# EAGLE design PCB_Tutorial (EAGLE 9.3.0)
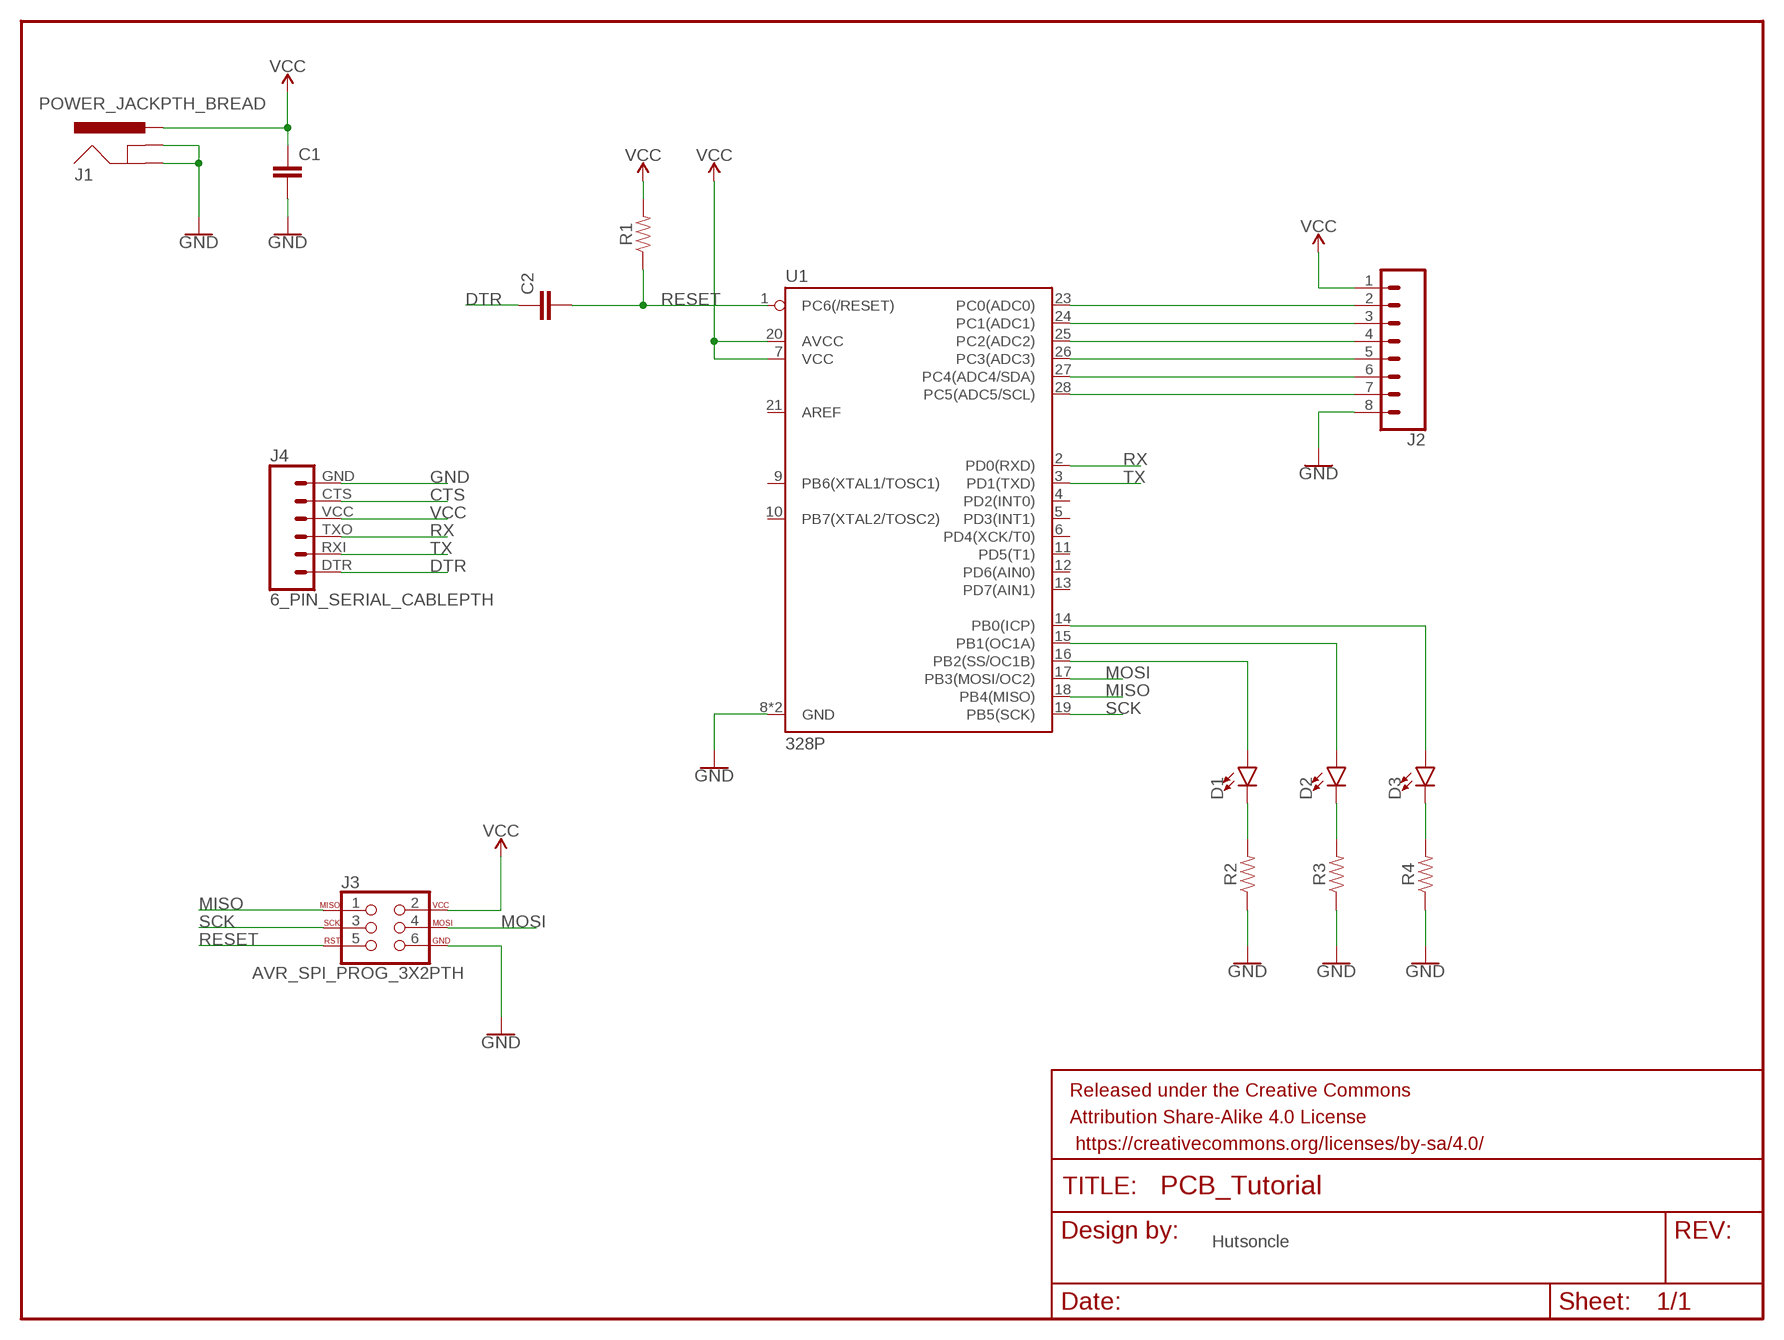
[diagram p0: schematic, sheet 1]

## Parts
C1  0.1uF  0.1UF-KIT-EZ-50V-20%  [CAP-PTH-SMALL-KIT]
C2  0.1uF  0.1UF-KIT-EZ-50V-20%  [CAP-PTH-SMALL-KIT]
D1  LED5MM  [LED_5MM]
D2  LED5MM  [LED_5MM]
D3  LED5MM  [LED_5MM]
FRAME1  FRAME-LETTER  [CREATIVE_COMMONS]
J1  POWER_JACKPTH_BREAD  [POWER_JACK_PTH_BREAD]
J2  CONN_08"  [1X08]
J3  AVR_SPI_PROG_3X2PTH  [2X3]
J4  6_PIN_SERIAL_CABLEPTH  [FTDI_BASIC]
R1  RESISTORAXIAL-0.3  [AXIAL-0.3]
R2  RESISTORAXIAL-0.3  [AXIAL-0.3]
R3  RESISTORAXIAL-0.3  [AXIAL-0.3]
R4  RESISTORAXIAL-0.3  [AXIAL-0.3]
U1  328P  ATMEGA328P_PDIP  [DIP28]

## Nets
CTS: J4.CTS
DTR: C2.1 J4.DTR
GND: C1.2 J1.GND J1.GNDBREAK J2.8 J3.6 J4.GND R2.P$1 R3.P$1 R4.P$1 U1.8(GND) U1.22(GND)
MISO: J3.1 U1.18(PB4(MISO))
MOSI: J3.4 U1.17(PB3(MOSI/OC2))
N$3: J2.2 U1.23(PC0(ADC0))
N$4: J2.3 U1.24(PC1(ADC1))
N$5: J2.4 U1.25(PC2(ADC2))
N$6: J2.5 U1.26(PC3(ADC3))
N$7: J2.6 U1.27(PC4(ADC4/SDA))
N$8: J2.7 U1.28(PC5(ADC5/SCL))
N$9: D1.K(C) R2.P$2
N$10: D2.K(C) R3.P$2
N$11: D3.K(C) R4.P$2
N$12: D3.A U1.14(PB0(ICP))
N$13: D2.A U1.15(PB1(OC1A))
N$14: D1.A U1.16(PB2(SS/OC1B))
RESET: C2.2 J3.5 R1.P$1 U1.1(PC6(/RESET))
RX: J4.TXO U1.2(PD0(RXD))
SCK: J3.3 U1.19(PB5(SCK))
TX: J4.RXI U1.3(PD1(TXD))
VCC: C1.1 J1.PWR J2.1 J3.2 J4.VCC R1.P$2 U1.7(VCC) U1.20(AVCC)
Unconnected: U1.4(PD2(INT0)) U1.5(PD3(INT1)) U1.6(PD4(XCK/T0)) U1.9(PB6(XTAL1/TOSC1)) U1.10(PB7(XTAL2/TOSC2)) U1.11(PD5(T1)) U1.12(PD6(AIN0)) U1.13(PD7(AIN1)) U1.21(AREF)

## Notes on the sheet
- Hutsoncle

## Library data of the parts
C1 C2 = SparkFun-Capacitors:0.1UF: 0.1µF ceramic capacitors A capacitor is a passive two-terminal electrical component used to store electrical energy temporarily in an electric field.; PROD_ID: CAP-08370
D1-D3 = SparkFun-LED:LED: LED (Generic) Standard schematic elements and footprints for 5mm, 3mm, 1206, and 0603 sized LEDs. Generic LEDs with no color specified.
FRAME1 = SparkFun-Aesthetics:FRAME-LETTER: Schematic Frame - Letter Standard 8.5x11 US Letter frame
J1 = SparkFun-Connectors:POWER_JACK: Power Jack Connector This is the standard 5.5mm barrel jack for power. The PTH is the most common, proven, reliable, footprint. The Slot footprint only works if the mill layer is transmitted to the PCB fab house so be warned. Here are the connectors we sell at SparkFun: DC Barrel Power Jack/Connector <https://www.sparkfun.com/products/119> (PRT-00119) DC Barrel Power Jack/Connector (SMD) <https://www.sparkfun.com/products/12748> (PRT-12748) DC Barrel Jack Adapter - Breadboard Compatible <https://www.sparkfun.com/products/10811> (PRT-10811) It is used on this SparkFun product (and many, many others): SparkFun RedBoard - Programmed with Arduino <https://www.sparkfun.com/products/12757> (DEV-12757) Also, if you need a mating power supply or connector, please check these out: Wall Adapter Power Supply - 9VDC 650mA <https://www.sparkfun.com/products/298> (TOL-00298) DC Barrel Jack Adapter - Male <https://www.sparkfun.com/products/10287> (PRT-10287); PROD_ID: PRT-10811
J2 = SparkFun-Connectors:CONN_08: Multi connection point. Often used as Generic Header-pin footprint for 0.1 inch spaced/style header connections On any of the 0.1 inch spaced packages, you can populate with these: Break Away Headers - Straight <https://www.sparkfun.com/products/116> (PRT-00116) Break Away Male Headers - Right Angle <https://www.sparkfun.com/products/553> (PRT-00553) Female Headers <https://www.sparkfun.com/products/115> (PRT-00115) Break Away Headers - Machine Pin <https://www.sparkfun.com/products/117> (PRT-00117) Break Away Female Headers - Swiss Machine Pin <https://www.sparkfun.com/products/743> (PRT-00743) Arduino Stackable Header - 8 Pin <https://www.sparkfun.com/products/9279> (PRT-09279) For SCREWTERMINALS and SPRING TERMINALS visit here: Screw Terimnals on SparkFun.com <https://www.sparkfun.com/search/results?term=Screw+Terminals> (5mm/3.5mm/2.54mm spacing) This device is also useful as a general connection point to wire up your design to another part of your project. Our various solder wires solder well into these plated through hole pads. Hook-Up Wire - Assortment (Stranded, 22 AWG) <https://www.sparkfun.com/products/11375> (PRT-11375) Hook-Up Wire - Assortment (Solid Core, 22 AWG) <https://www.sparkfun.com/products/11367> (PRT-11367) View the entire wire category on our website here <https://www.sparkfun.com/categories/141> Special notes: Molex polarized connector foot print use with SKU : PRT-08231 with associated crimp pins and housings. 1MM SMD Version SKU: PRT-10208 NOTES ON THE VARIANTS LOCK and LOCK_LONGPADS... This footprint was designed to help hold the alignment of a through-hole component (i.e. 6-pin header) while soldering it into place. You may notice that each hole has been shifted either up or down by 0.005 of an inch from it's more standard position (which is a perfectly straight line). This slight alteration caused the pins (the squares in the middle) to touch the edges of the holes. Because they are alternating, it causes a "brace" to hold the component in place. 0.005 has proven to be the perfect amount of "off-center" position when using our standard breakaway headers. Although looks a little odd when you look at the bare footprint, once you have a header in there, the alteration is very hard to notice. Also,if you push a header all the way into place, it is covered up entirely on the bottom side.; PROD_ID: CONN-08438
J3 = SparkFun-Connectors:AVR_SPI_PROG_3X2: AVR ISP 6 Pin This is the reduced ISP connector for AVR programming. Common on Arduino. This footprint will take up less PCB space and can be used with a 10-pin to 6-pin adapter such as SKU: BOB-08508 **Special note about "TEST_POINT" package. The stop mask is on the top side, so if you want your programming test points to be on the bottom of your board, make sure to place this package on the bottom side of the board. This also ensure that the orientation to program from the bottom side will be correct. SparkFun Products: SparkFun ISP Pogo Adapter <https://www.sparkfun.com/products/11591> - NS Tiny AVR Programmer <https://www.sparkfun.com/products/11801> -PTH
J4 = SparkFun-Connectors:6_PIN_SERIAL_CABLE: 6-pin header connection for use with the "FTDI BASIC" pinout - CABLE SIDE. Also known as "Arduino Serial Program Header". This is used on a design to provide a 6-pin connection point for serial communication usually from a USB cable (D+/D-) to these headers (RX/TX). It also has the remaining pins necessary for programming in the Arduino evironment (DTR, GND, and sometimes VCC). Note, this device has "CABLE" in the name. It is intended to be used on a design that usually lives on the end of your USB cable and prvides the converter chip (FTDI232 or FTDI231x) to commnicate serial RX/TX. The "sister" device, named "TARGET" is inteneded to be used on a design that contains a target micro-controller that you wish to program. You can populate with some of these: Female Headers <https://www.sparkfun.com/products/115> (PRT-00115) For reference (or to suit your programming needs) check out these designs: SparkFun FTDI Basic Breakout - 5V <https://www.sparkfun.com/products/9716> (DEV-09716) SparkFun FTDI Basic Breakout - 3.3V <https://www.sparkfun.com/products/9873> (DEV-09873) SparkFun FTDI SmartBasic <https://www.sparkfun.com/products/12935> (DEV-12935) SparkFun Beefy 3 - FTDI Basic Breakout <https://www.sparkfun.com/products/13746> (DEV-13746)
R1-R4 = SparkFun-Resistors:RESISTOR: Generic Resistor Package
U1 = SparkFun-IC-Microcontroller:ATMEGA328P_PDIP: Atmel 328P Through hole ATMEGA328P uC used in the Arduino 32kb flash, 1k EEPROM, 2k SRAM Datasheet <http://www.sparkfun.com/datasheets/Components/SMD/ATMega328.pdf> SparkFun Products Storefront component: AVR 28 Pin 20MHz 32K 6A/D - ATMega328P <https://www.sparkfun.com/products/9061> (COM-09061) SparkFun Simon Says - Through-Hole Soldering Kit <https://www.sparkfun.com/products/10547> (KIT-10547) SparkFun Learn to Solder - Simon Says <https://www.sparkfun.com/products/13708> (KIT-13708) SparkFun BigTime Watch Kit <https://www.sparkfun.com/products/11734> (KIT-11734) SparkFun ClockIt <https://www.sparkfun.com/products/10930> (KIT-10930) SparkFun Serial Enabled LCD Kit <https://www.sparkfun.com/products/10097> (LCD-10097) SparkFun Simon Tilts - Through Hole Soldering Kit <https://www.sparkfun.com/products/12634> (KIT-12634) SparkFun Frequency Counter Kit <https://www.sparkfun.com/products/10140> (KIT-10140) FabFM Radio Kit <https://www.sparkfun.com/products/11043> (KIT-11043) SparkFun Binary Blaster Kit <https://www.sparkfun.com/products/12037> (KIT-12037) SparkFun Metro-Gnome <https://www.sparkfun.com/products/9236> (KIT-09236) ATmega328 with Arduino Optiboot (Uno) <https://www.sparkfun.com/products/10524> (DEV-10524); PROD_ID: IC-09136

## Board
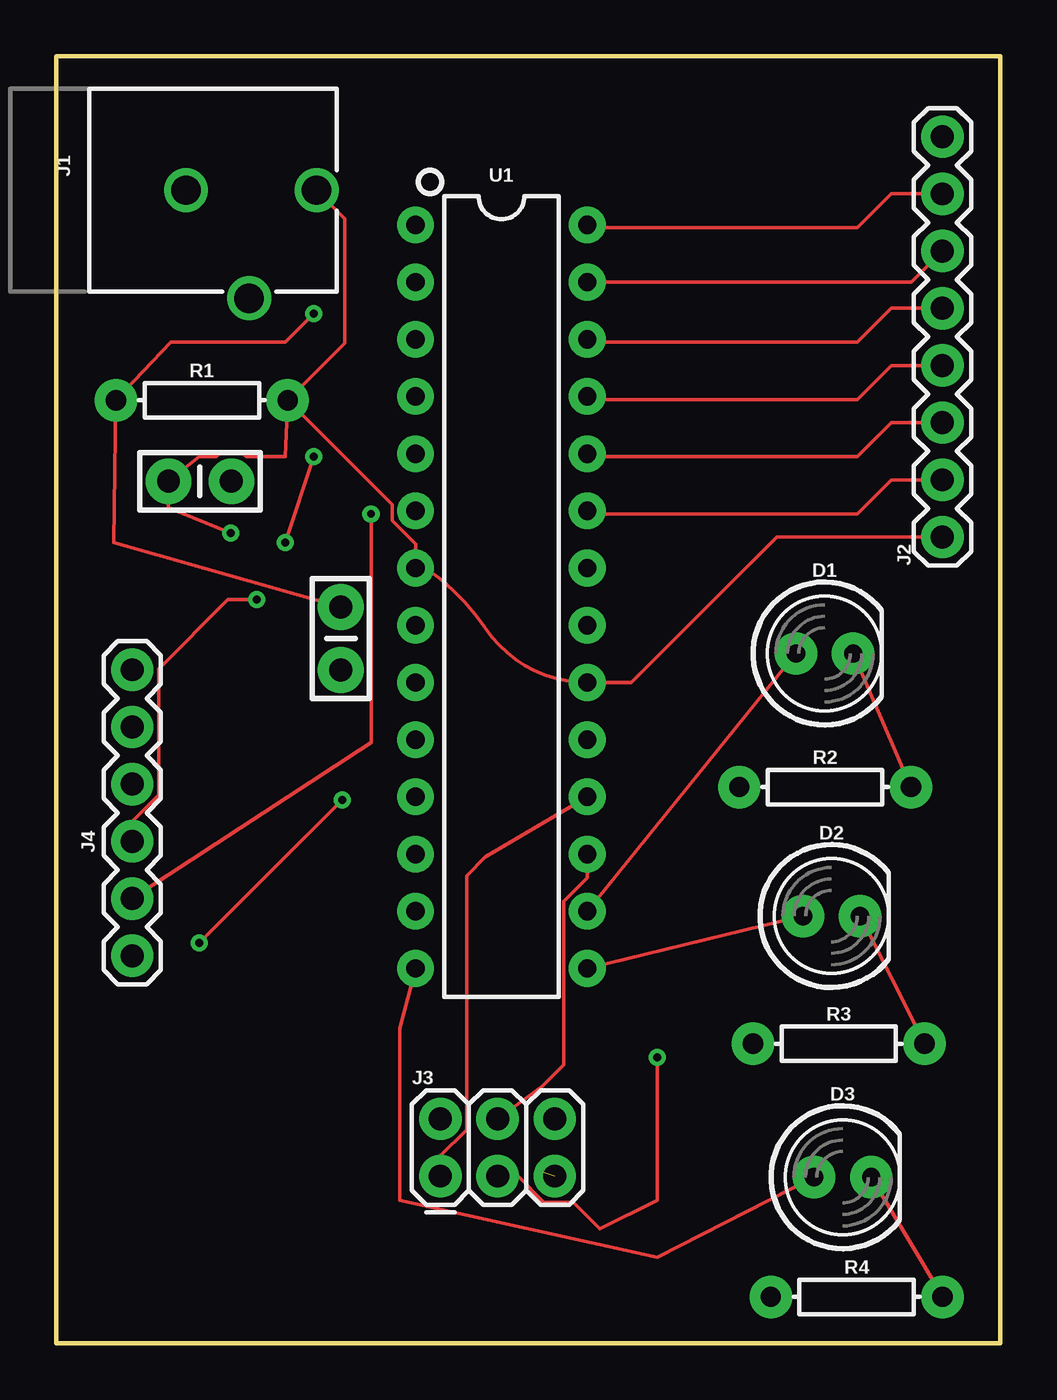
[diagram p1: board, top side]
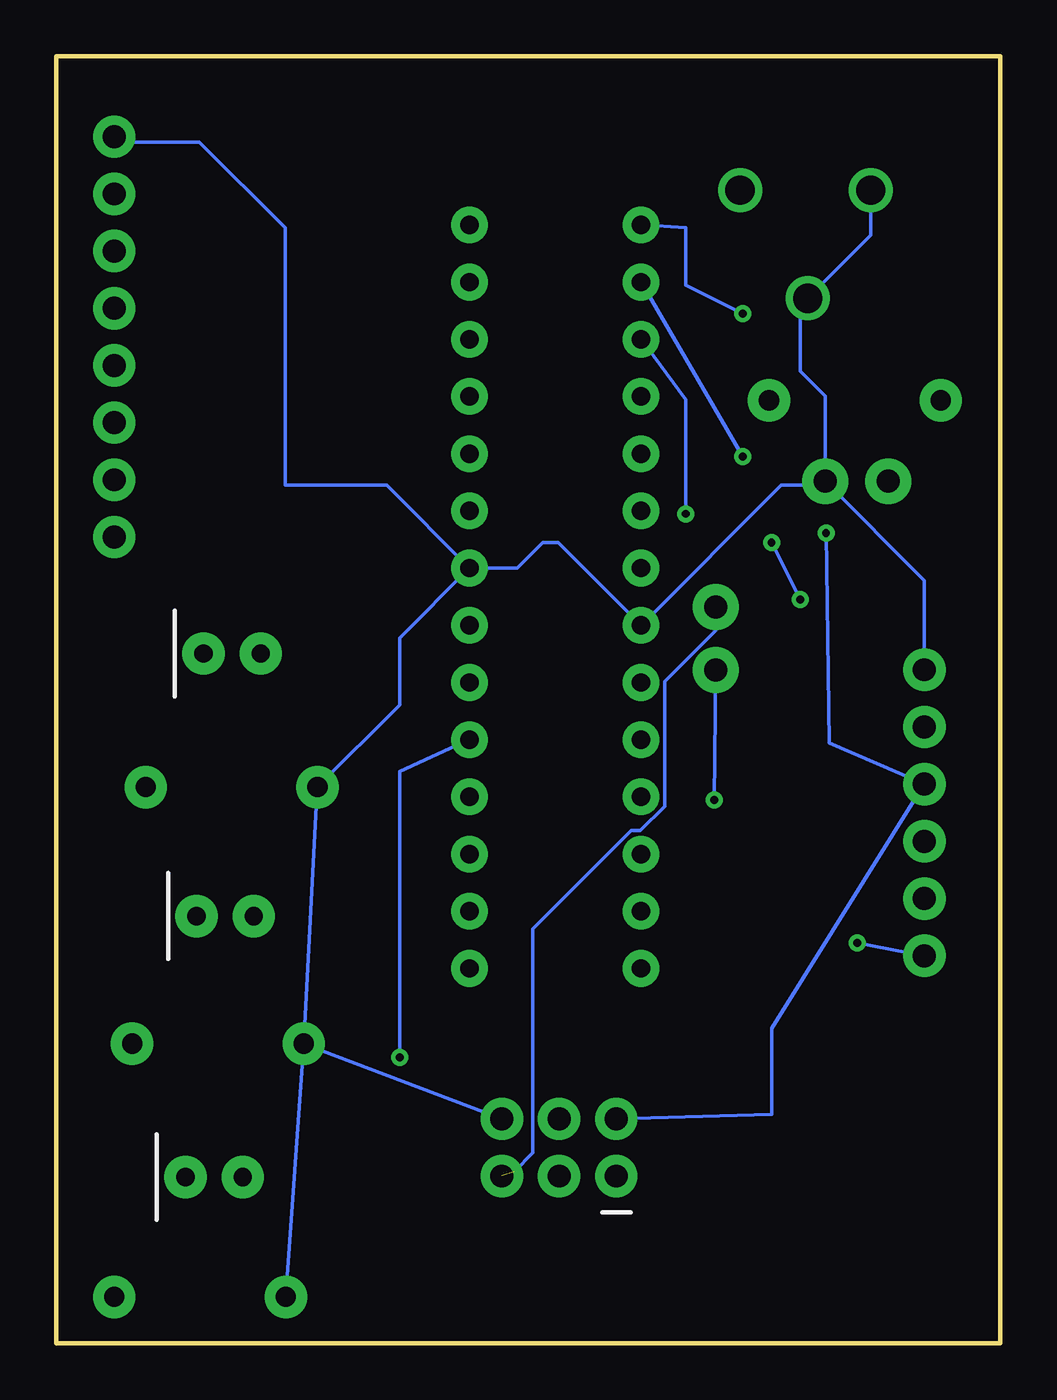
[diagram p2: board, bottom side, seen from below]

Size 41.91 x 57.15 mm. Coordinates in mm from the lower left corner, seen from the top.
Outline: 0,57.15 0,0 41.91,0 41.91,57.15 0,57.15
Copper layers (1*16): Top 0.035mm / dielectric 1.5mm / Bottom 0.035mm
Design rules "default": minimum track width 6mil, minimum drill 0.35mm, track to track 6mil, track to pad 6mil, pad to pad 6mil, via to via 6mil, smd to smd 6mil, copper to edge 40mil, drill to drill 6mil, minimum pad ring 10mil, minimum via ring 8mil, stop-mask expansion 4mil, vias tented up to drill 0mil, thermal gap 10mil

### Footprints (pad centres in the part's own frame; a part is rotated, then mirrored left to right if it is on the bottom)
CAP-PTH-SMALL-KIT = drill 1.016 pad 2.032: 1 -1.397,0; 2 1.397,0
LED_5MM = drill 0.813 pad 1.88: A -1.27,0; K 1.27,0
POWER_JACK_PTH_BREAD = drill 1.3: GND 0,7.9; GNDBREAK 4.8,10.7; PWR 0,13.7
1X08 = drill 1.016 pad 1.88: 1 0,0; 2 2.54,0; 3 5.08,0; 4 7.62,0; 5 10.16,0; 6 12.7,0; 7 15.24,0; 8 17.78,0
2X3 = drill 1.016 pad 1.88: 1 0,0; 2 0,2.54; 3 2.54,0; 4 2.54,2.54; 5 5.08,0; 6 5.08,2.54
FTDI_BASIC = drill 1.016 pad 1.88: CTS 10.16,0; DTR 0,0; GND 12.7,0; RXI 2.54,0; TXO 5.08,0; VCC 7.62,0
AXIAL-0.3 = drill 0.9 pad 1.88: P$1 -3.81,0; P$2 3.81,0
DIP28 = drill 0.813 pad 1.626: 1 -16.51,-3.81; 2 -13.97,-3.81; 3 -11.43,-3.81; 4 -8.89,-3.81; 5 -6.35,-3.81; 6 -3.81,-3.81; 7 -1.27,-3.81; 8 1.27,-3.81; 9 3.81,-3.81; 10 6.35,-3.81; 11 8.89,-3.81; 12 11.43,-3.81; 13 13.97,-3.81; 14 16.51,-3.81; 15 16.51,3.81; 16 13.97,3.81; 17 11.43,3.81; 18 8.89,3.81; 19 6.35,3.81; 20 3.81,3.81; 21 1.27,3.81; 22 -1.27,3.81; 23 -3.81,3.81; 24 -6.35,3.81; 25 -8.89,3.81; 26 -11.43,3.81; 27 -13.97,3.81; 28 -16.51,3.81

### Placement (x,y rotation side)
C1  6.38,38.28 0 top
C2  12.63,31.29 90 top
D1  34.1,30.63 0 top
D2  34.41,18.97 0 top
D3  34.9,7.37 0 top
FRAME1  -91.44,-8.89 0 top  (outside the outline)
J1  -2.14,51.2 270 top
J2  39.34,35.8 90 top
J3  17.05,7.42 0 top
J4  3.37,17.21 90 top
R1  6.46,41.87 0 top
R2  34.13,24.7 0 top
R3  34.73,13.3 0 top
R4  35.53,2.06 0 top
U1  19.76,33.15 270 top

### Tracks (layer width: path | path; a pad name or v marks a point on that pad's centre or on a via)
DTR  (via drill 0.35)
  Top 0.152: v6.35,17.78 v12.7,24.13
  Bottom 0.152: J4.DTR v6.35,17.78 | v12.7,24.13 C2.1
GND
  Bottom 0.152: J2.8 39.1,53.34 35.56,53.34 31.75,49.53 31.75,38.1 27.25,38.1 U1.22 | U1.22 21.46,34.42 20.32,35.56 19.63,35.56 U1.8 9.73,38.1 7.62,38.1 7.62,38.12 C1.2 | C1.2 7.77,42.06 8.89,43.18 8.89,46.07 J1.GNDBREAK 5.76,49.2 J1.GND | C1.2 3.37,33.88 J4.GND | U1.22 26.67,31.32 26.67,28.35 R2.P$1 R3.P$1 | R3.P$1 R4.P$1 | R3.P$1 J3.6
MISO
  Top 0.152: J3.1 17.05,8.31 18.22,9.48 18.22,20.76 19.05,21.59 U1.18
MOSI
  Top 0.152: U1.17 23.57,20.66 22.53,19.61 22.53,12.37 21.59,11.43 J3.4
N$3
  Top 0.152: J2.2 37.07,38.34 35.56,36.83 23.7,36.83 U1.23
N$4
  Top 0.152: J2.3 37.07,40.88 35.56,39.37 23.7,39.37 U1.24
N$5
  Top 0.152: J2.4 37.07,43.42 35.56,41.91 23.7,41.91 U1.25
N$6
  Top 0.152: J2.5 37.07,45.96 35.56,44.45 23.7,44.45 U1.26
N$7
  Top 0.152: J2.6 37.96,47.12 U1.27
N$8
  Top 0.152: J2.7 37.07,51.04 35.56,49.53 23.7,49.53 U1.28
N$9
  Top 0.152: D1.K R2.P$2
N$10
  Top 0.152: D2.K R3.P$2
N$11
  Top 0.152: D3.K R4.P$2
N$12
  Top 0.152: D3.A 26.67,3.81 15.24,6.35 15.24,13.97 U1.14
N$13
  Top 0.152: U1.15 D2.A
N$14
  Top 0.152: D1.A U1.16
RESET  (via drill 0.35)  (1 unrouted)
  Top 0.152: v11.43,45.72 10.16,44.45 5.08,44.45 R1.P$1 2.54,35.56 C2.2
  Bottom 0.152: v11.43,45.72 13.97,46.99 13.97,49.53 U1.1 | C2.2 12.63,31.66 14.91,29.38 14.91,23.83 15.98,22.76 16.38,22.76 20.76,18.39 20.76,8.45 21.59,7.62
RX  (via drill 0.35)
  Top 0.152: J4.TXO 3.37,23.18 4.54,24.34 4.54,29.94 7.62,33.02 v8.89,33.02 | v10.16,35.56 v11.43,39.37
  Bottom 0.152: v8.89,33.02 v10.16,35.56 | v11.43,39.37 U1.2
SCK  (via drill 0.35)
  Top 0.152: v26.67,12.7 26.67,6.35 24.13,5.08 22.95,6.26 21.65,6.26 20.48,7.42 J3.3
  Bottom 0.152: U1.19 26.67,25.4 v26.67,12.7
TX  (via drill 0.35)
  Top 0.152: J4.RXI 13.97,26.67 v13.97,36.83
  Bottom 0.152: v13.97,36.83 13.97,41.91 U1.3
VCC  (via drill 0.35)
  Top 0.152: J2.1 31.99,35.8 25.53,29.34 U1.20 arc-56 19.05,31.75 arc22 16.38,34.42 U1.7 15.95,35.49 14.91,36.53 14.91,37.23 R1.P$2 | R1.P$2 12.81,44.41 12.81,49.95 J1.PWR | R1.P$2 10.16,39.37 8.44,39.37 8.29,39.52 7.26,39.52 7.11,39.37 6.35,39.37 C1.1 4.98,37.1 v7.74,35.98
  Bottom 0.152: v7.74,35.98 7.6,26.66 J4.VCC 10.16,13.97 10.16,10.16 J3.2